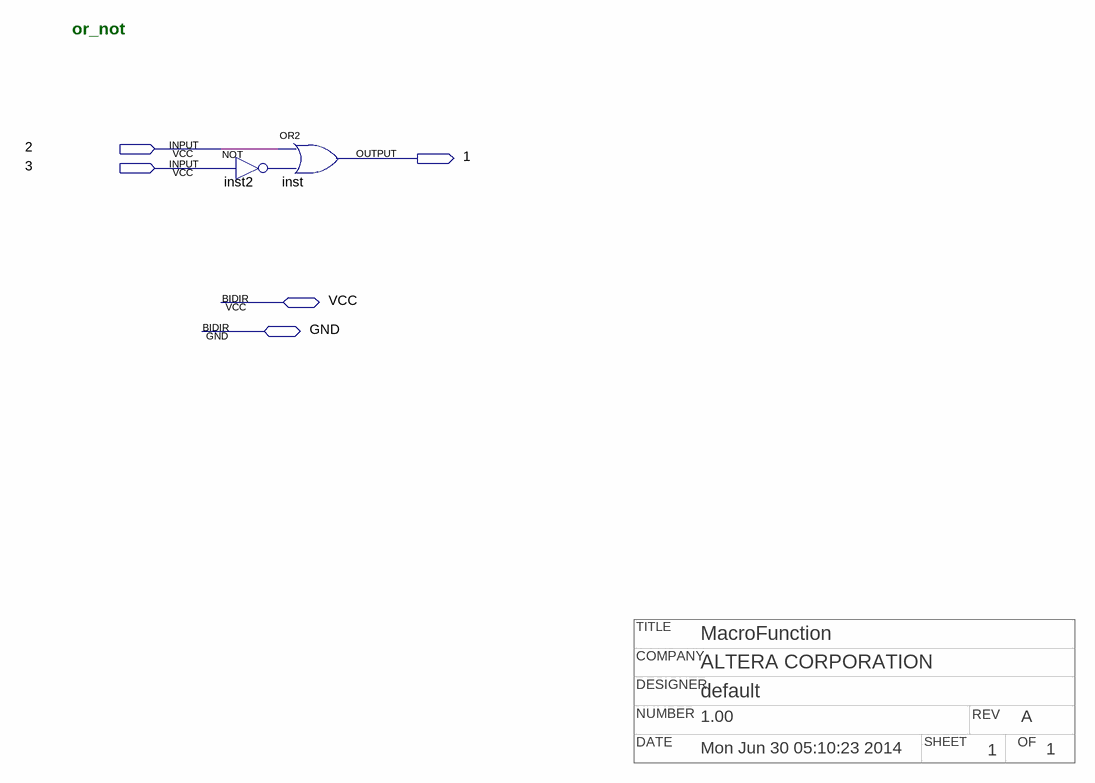
[diagram p0: schematic sheet]
// Quartus schematic npor_not.bdf as structural Verilog: 2 symbols, 5 pins
// Title block: TITLE: MacroFunction; COMPANY: ALTERA CORPORATION; DESIGNER: default; NUMBER: 1.00; REV: A; DATE: Mon Jun 30 05:10:23 2014; SHEET: 1; OF: 1
module npor_not (
  input  \2 ,
  input  \3 ,
  inout  VCC,
  inout  GND,
  output \1 
);

  wire inst2_out;

  not inst2 (inst2_out, \3 );
  or inst (\1 , \2 , inst2_out);

  // Notes on the sheet:
  //   or_not
endmodule
